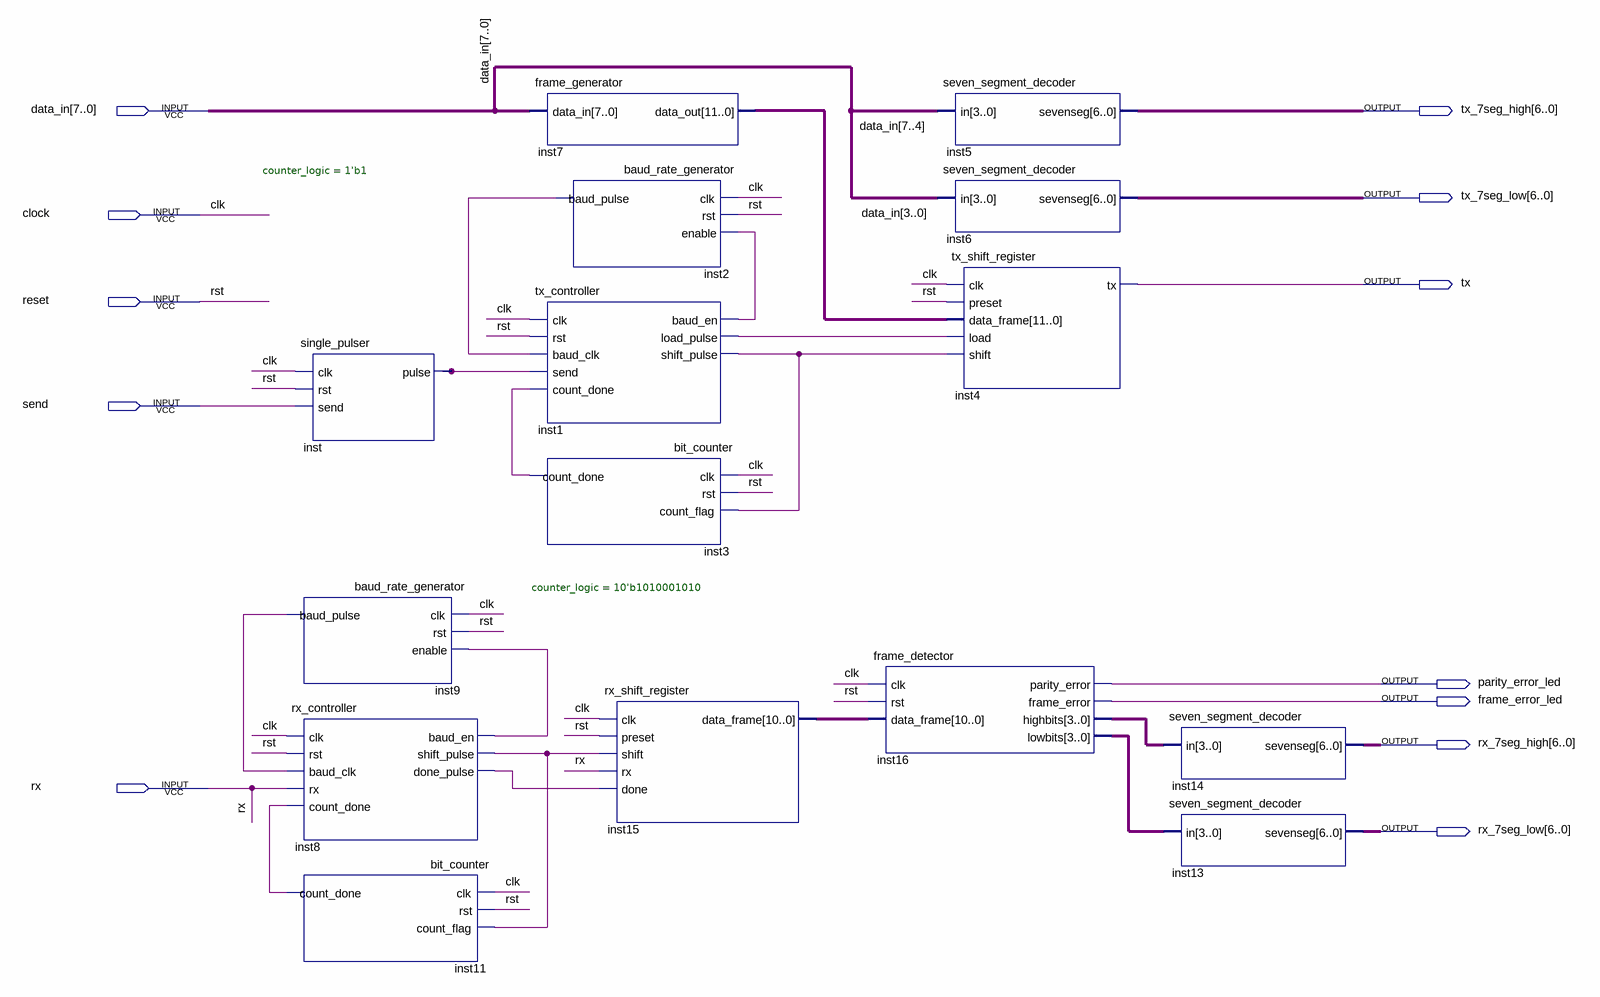
[diagram p0: schematic sheet]
// Quartus schematic UART.bdf as structural Verilog: 15 symbols, 12 pins
module UART (
  input  [7:0] data_in,
  input  clock,
  input  reset,
  input  send,
  input  rx,
  output [6:0] tx_7seg_high,
  output [6:0] tx_7seg_low,
  output tx,
  output parity_error_led,
  output frame_error_led,
  output [6:0] rx_7seg_high,
  output [6:0] rx_7seg_low
);

  wire inst1_baud_en, inst1_load_pulse, inst1_shift_pulse, inst2_baud_pulse, inst3_count_done, inst8_baud_en,
       inst8_done_pulse, inst8_shift_pulse, inst9_baud_pulse, inst11_count_done, inst_pulse;
  wire [3:0] inst16_highbits, inst16_lowbits;
  wire [10:0] inst15_data_frame;
  wire [11:0] inst7_data_out;

  single_pulser inst (.clk(clock), .rst(reset), .send(send), .pulse(inst_pulse));
  baud_rate_generator #(.counter_logic(10'b1010001010)) inst9 (
    .clk(clock), .rst(reset), .enable(inst8_baud_en), .baud_pulse(inst9_baud_pulse));
  rx_controller inst8 (
    .clk(clock), .rst(reset), .baud_clk(inst9_baud_pulse), .rx(rx), .count_done(inst11_count_done),
    .baud_en(inst8_baud_en), .shift_pulse(inst8_shift_pulse), .done_pulse(inst8_done_pulse));
  bit_counter inst11 (.clk(clock), .rst(reset), .count_flag(inst8_shift_pulse), .count_done(inst11_count_done));
  frame_generator inst7 (.data_in(data_in), .data_out(inst7_data_out));
  baud_rate_generator #(.counter_logic(1'b1)) inst2 (
    .clk(clock), .rst(reset), .enable(inst1_baud_en), .baud_pulse(inst2_baud_pulse));
  tx_controller inst1 (
    .clk(clock), .rst(reset), .baud_clk(inst2_baud_pulse), .send(inst_pulse), .count_done(inst3_count_done),
    .baud_en(inst1_baud_en), .load_pulse(inst1_load_pulse), .shift_pulse(inst1_shift_pulse));
  bit_counter inst3 (.clk(clock), .rst(reset), .count_flag(inst1_shift_pulse), .count_done(inst3_count_done));
  rx_shift_register inst15 (
    .clk(clock), .preset(reset), .shift(inst8_shift_pulse), .rx(rx), .done(inst8_done_pulse),
    .data_frame(inst15_data_frame));
  frame_detector inst16 (
    .clk(clock), .rst(reset), .data_frame(inst15_data_frame), .parity_error(parity_error_led),
    .frame_error(frame_error_led), .highbits(inst16_highbits), .lowbits(inst16_lowbits));
  seven_segment_decoder inst5 (.in(data_in[7:4]), .sevenseg(tx_7seg_high));
  seven_segment_decoder inst6 (.in(data_in[3:0]), .sevenseg(tx_7seg_low));
  tx_shift_register inst4 (
    .clk(clock), .preset(reset), .data_frame(inst7_data_out), .load(inst1_load_pulse),
    .shift(inst1_shift_pulse), .tx(tx));
  seven_segment_decoder inst14 (.in(inst16_highbits), .sevenseg(rx_7seg_high));
  seven_segment_decoder inst13 (.in(inst16_lowbits), .sevenseg(rx_7seg_low));

  // Other names for the same wires on the sheet: clk = clock; rst = reset
endmodule
